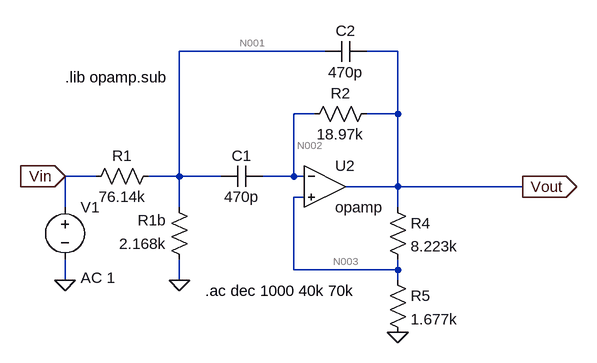
[diagram p0: schematic cell1_sim.asc]
cell1_sim.asc, the LTspice schematic file:
Version 4
SHEET 1 1440 680
WIRE 448 -32 224 -32
WIRE 560 -32 512 -32
WIRE 432 64 400 64
WIRE 560 64 560 -32
WIRE 560 64 512 64
WIRE 96 160 48 160
WIRE 224 160 224 -32
WIRE 224 160 176 160
WIRE 288 160 224 160
WIRE 400 160 400 64
WIRE 400 160 352 160
WIRE 416 160 400 160
WIRE 560 176 560 64
WIRE 560 176 480 176
WIRE 752 176 560 176
WIRE 416 192 400 192
WIRE 48 208 48 160
WIRE 224 208 224 160
WIRE 560 208 560 176
WIRE 400 304 400 192
WIRE 560 304 560 288
WIRE 560 304 400 304
WIRE 48 320 48 288
WIRE 224 320 224 288
WIRE 560 320 560 304
FLAG 224 320 0
FLAG 560 400 0
FLAG 48 320 0
FLAG 48 160 Vin
IOPIN 48 160 In
FLAG 752 176 Vout
IOPIN 752 176 Out
SYMBOL res 192 144 R90
WINDOW 0 0 56 VBottom 2
WINDOW 3 32 56 VTop 2
SYMATTR InstName R1
SYMATTR Value 76.14k
SYMBOL res 240 304 R180
WINDOW 0 36 76 Left 2
WINDOW 3 36 40 Left 2
SYMATTR InstName R1b
SYMATTR Value 2.168k
SYMBOL res 528 48 R90
WINDOW 0 0 56 VBottom 2
WINDOW 3 32 56 VTop 2
SYMATTR InstName R2
SYMATTR Value 18.97k
SYMBOL res 544 192 R0
SYMATTR InstName R4
SYMATTR Value 8.223k
SYMBOL res 544 304 R0
SYMATTR InstName R5
SYMATTR Value 1.677k
SYMBOL cap 352 144 R90
WINDOW 0 0 32 VBottom 2
WINDOW 3 32 32 VTop 2
SYMATTR InstName C1
SYMATTR Value 470p
SYMBOL cap 512 -48 R90
WINDOW 0 0 32 VBottom 2
WINDOW 3 32 32 VTop 2
SYMATTR InstName C2
SYMATTR Value 470p
SYMBOL Opamps\\opamp 448 112 R0
SYMATTR InstName U2
SYMBOL voltage 48 192 R0
WINDOW 123 24 124 Left 2
WINDOW 39 0 0 Left 0
SYMATTR Value2 AC 1
SYMATTR InstName V1
SYMATTR Value ""
TEXT 264 336 Left 2 !.ac dec 1000 40k 70k
TEXT 48 8 Left 2 !.lib opamp.sub

The netlist it stands for:
* cell1_sim.asc
R1 N001 Vin 76.14k
R1b 0 N001 2.168k
R2 Vout N002 18.97k
R4 Vout N003 8.223k
R5 N003 0 1.677k
C1 N002 N001 470p
C2 Vout N001 470p
XU2 N002 N003 Vout opamp Aol=100K GBW=10Meg  ; pins invin noninvin out
V1 Vin 0 AC 1
.ac dec 1000 40k 70k
.lib opamp.sub
.backanno
.end

* Results of the author's LTspice run, read from the files saved beside the schematic
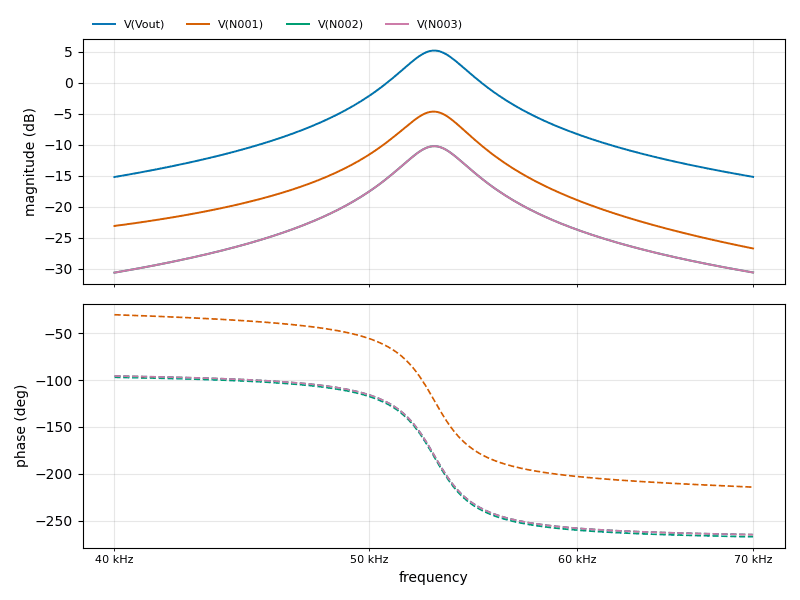
[diagram p1: AC Analysis of cell1_sim.asc, plotted from the saved traces]
* AC Analysis, 1 run:
*   V(Vout): -15.22 dB at 40 kHz, -15.20 dB at 70 kHz, peak 5.17 dB at 52.97 kHz, 3 dB below the peak at 51.51 kHz and 54.4 kHz
*   V(N001): -23.11 dB at 40 kHz, -26.75 dB at 70 kHz, peak -4.67 dB at 52.85 kHz, 3 dB below the peak at 51.45 kHz and 54.34 kHz
*   V(N002): -30.64 dB at 40 kHz, -30.61 dB at 70 kHz, peak -10.24 dB at 52.97 kHz, 3 dB below the peak at 51.51 kHz and 54.4 kHz
*   V(N003): -30.65 dB at 40 kHz, -30.62 dB at 70 kHz, peak -10.25 dB at 52.97 kHz, 3 dB below the peak at 51.51 kHz and 54.4 kHz